# EAGLE design outin_shield (EAGLE 7.2.0)
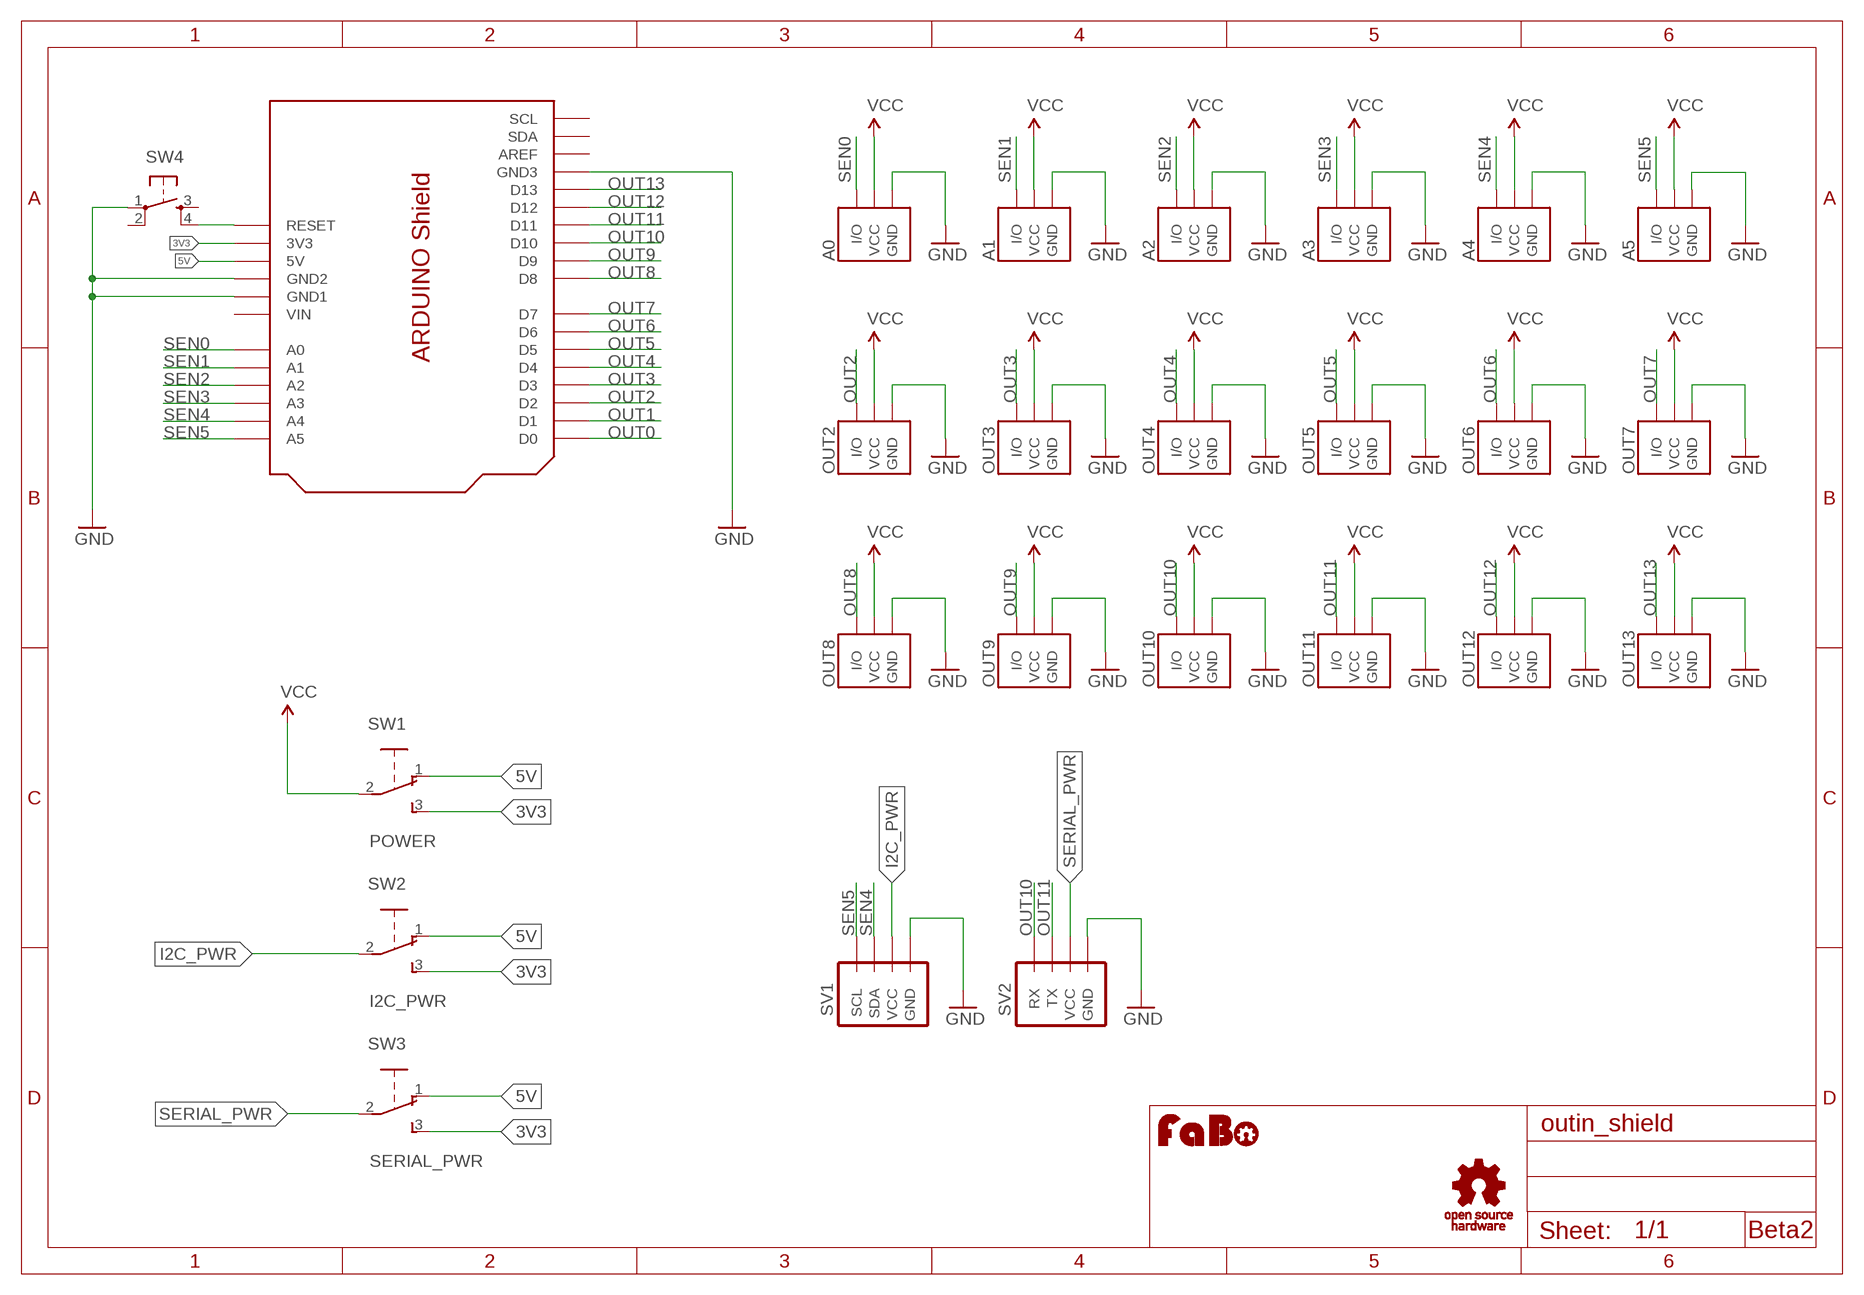
[diagram p0: schematic, sheet 1]

## Parts
A0  IO_PIN-3PIN  [1X3-SNEAKY]
A1  IO_PIN-3PIN  [1X3-SNEAKY]
A2  IO_PIN-3PIN  [1X3-SNEAKY]
A3  IO_PIN-3PIN  [1X3-SNEAKY]
A4  IO_PIN-3PIN  [1X3-SNEAKY]
A5  IO_PIN-3PIN  [1X3-SNEAKY]
OUT2  IO_PIN-3PIN  [1X3-SNEAKY]
OUT3  IO_PIN-3PIN  [1X3-SNEAKY]
OUT4  IO_PIN-3PIN  [1X3-SNEAKY]
OUT5  IO_PIN-3PIN  [1X3-SNEAKY]
OUT6  IO_PIN-3PIN  [1X3-SNEAKY]
OUT7  IO_PIN-3PIN  [1X3-SNEAKY]
OUT8  IO_PIN-3PIN  [1X3-SNEAKY]
OUT9  IO_PIN-3PIN  [1X3-SNEAKY]
OUT10  IO_PIN-3PIN  [1X3-SNEAKY]
OUT11  IO_PIN-3PIN  [1X3-SNEAKY]
OUT12  IO_PIN-3PIN  [1X3-SNEAKY]
OUT13  IO_PIN-3PIN  [1X3-SNEAKY]
SV1  BRICK_I2C_CONNECTOR  [BRICK_I2C_CONNECTOR]
SV2  BRICK_SERIAL_CONNECTOR  [BRICK_SERIAL_CONNECTOR]
SW1  POWER  SWITCH-SLIDE-EG1218  [EG1218]
SW2  I2C_PWR  SWITCH-SLIDE-EG1218  [EG1218]
SW3  SERIAL_PWR  SWITCH-SLIDE-EG1218  [EG1218]
SW4  SWITCH-TACT-6MM  [DTS_6_V]
U1  OUTIN_SHIELD  [ARDUINO_UNO_R3_OUTIN]
U$4  LOGO_OSHW_T-M  [LOGO_OSHW_T_M]
U$5  LOGO_FABO-M  [LOGO_FABO_M]

## Nets
3V3 [POWER]: SW1.3 SW2.3 SW3.3 U1.3V3
5V [POWER]: SW1.1 SW2.1 SW3.1 U1.5V
GND [POWER]: A0.1(GND) A1.1(GND) A2.1(GND) A3.1(GND) A4.1(GND) A5.1(GND) OUT2.1(GND) OUT3.1(GND) OUT4.1(GND) OUT5.1(GND) OUT6.1(GND) OUT7.1(GND) OUT8.1(GND) OUT9.1(GND) OUT10.1(GND) OUT11.1(GND) OUT12.1(GND) OUT13.1(GND) SV1.GND SV2.GND SW4.1 U1.GND1 U1.GND2 U1.GND3
I2C_PWR [POWER]: SV1.VCC SW2.2
OUT0: U1.D0
OUT1: U1.D1
OUT2: OUT2.3(I/O) U1.D2
OUT3: OUT3.3(I/O) U1.D3
OUT4: OUT4.3(I/O) U1.D4
OUT5: OUT5.3(I/O) U1.D5
OUT6: OUT6.3(I/O) U1.D6
OUT7: OUT7.3(I/O) U1.D7
OUT8: OUT8.3(I/O) U1.D8
OUT9: OUT9.3(I/O) U1.D9
OUT10: OUT10.3(I/O) SV2.RX U1.D10
OUT11: OUT11.3(I/O) SV2.TX U1.D11
OUT12: OUT12.3(I/O) U1.D12
OUT13: OUT13.3(I/O) U1.D13
RESET: SW4.4 U1.RESET
SEN0: A0.3(I/O) U1.A0
SEN1: A1.3(I/O) U1.A1
SEN2: A2.3(I/O) U1.A2
SEN3: A3.3(I/O) U1.A3
SEN4: A4.3(I/O) SV1.SDA U1.A4
SEN5: A5.3(I/O) SV1.SCL U1.A5
SERIAL_PWR [POWER]: SV2.VCC SW3.2
VCC [POWER]: A0.2(VCC) A1.2(VCC) A2.2(VCC) A3.2(VCC) A4.2(VCC) A5.2(VCC) OUT2.2(VCC) OUT3.2(VCC) OUT4.2(VCC) OUT5.2(VCC) OUT6.2(VCC) OUT7.2(VCC) OUT8.2(VCC) OUT9.2(VCC) OUT10.2(VCC) OUT11.2(VCC) OUT12.2(VCC) OUT13.2(VCC) SW1.2
Unconnected: SW4.2 SW4.3 U1.AREF U1.SCL U1.SDA

## Notes on the sheet
- Beta2

## Power pins joined to a net without a drawn wire
VIN: U1.VIN

## Library data of the parts
A0 A1-A5 OUT2-OUT13 = Gclue:IO_PIN
SV1 = Gclue:BRICK_I2C_CONNECTOR: Brick Connector female for OUT/IN Shield
SV2 = Gclue:BRICK_SERIAL_CONNECTOR
SW1-SW3 = Gclue:SWITCH-SLIDE
SW4 = Gclue:SWITCH-TACT
U1 = Gclue:OUTIN_SHIELD
U$4 = Gclue:LOGO_OSHW_T
U$5 = FaBo:LOGO_FABO

## Net classes
1 POWER: width 0.406 mm

## Board
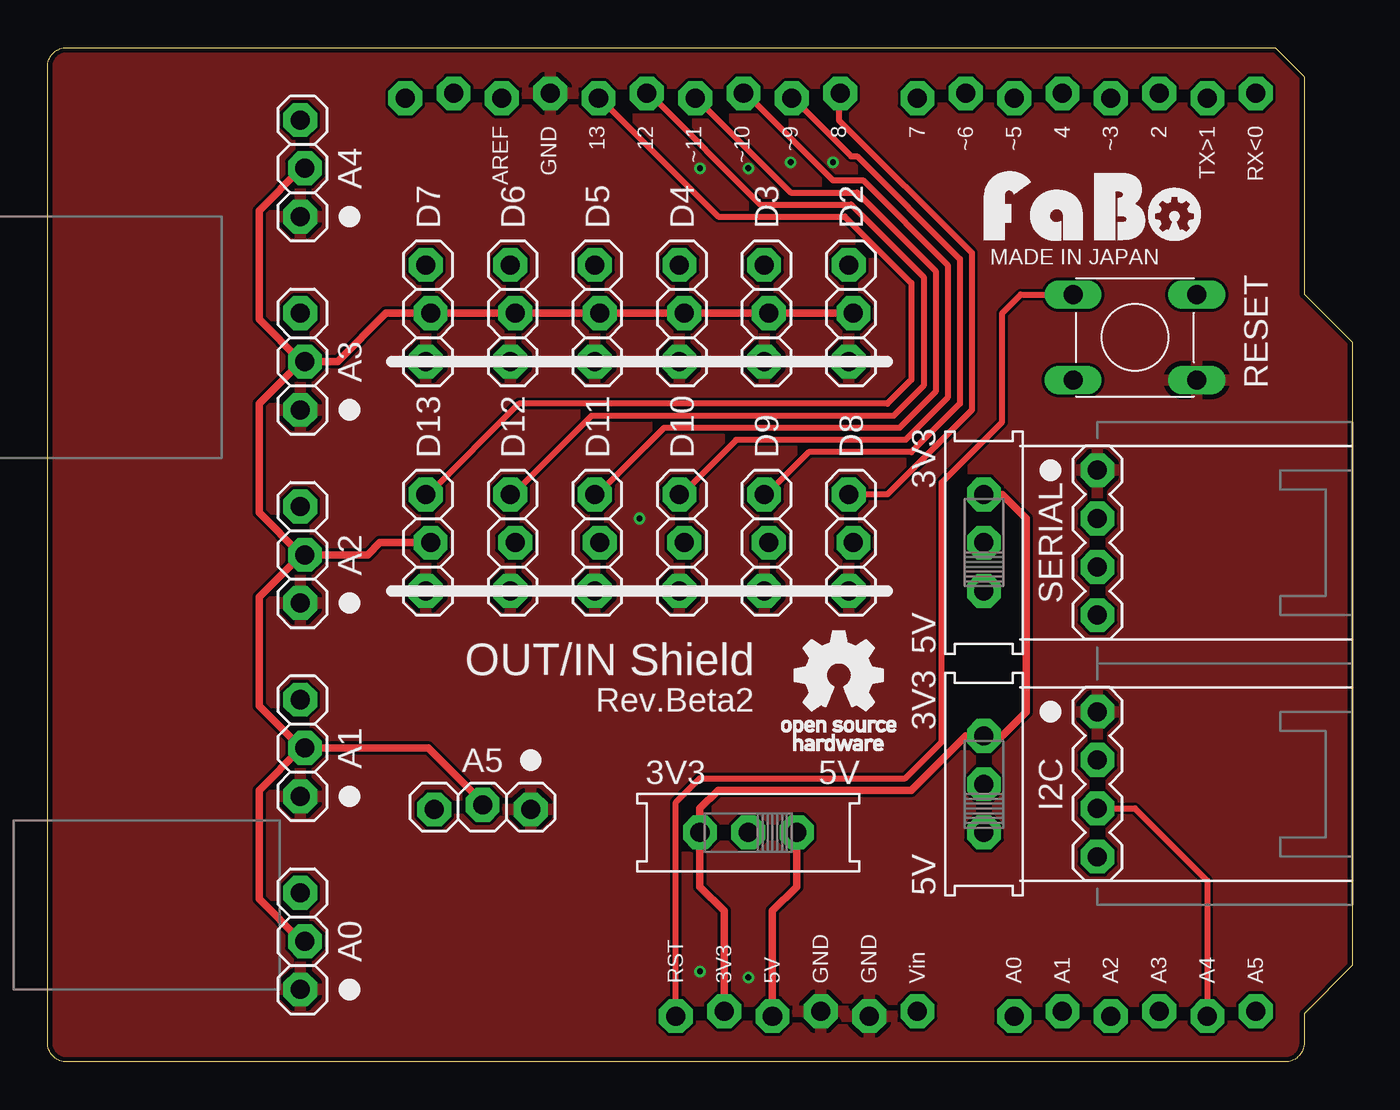
[diagram p1: board, top side]
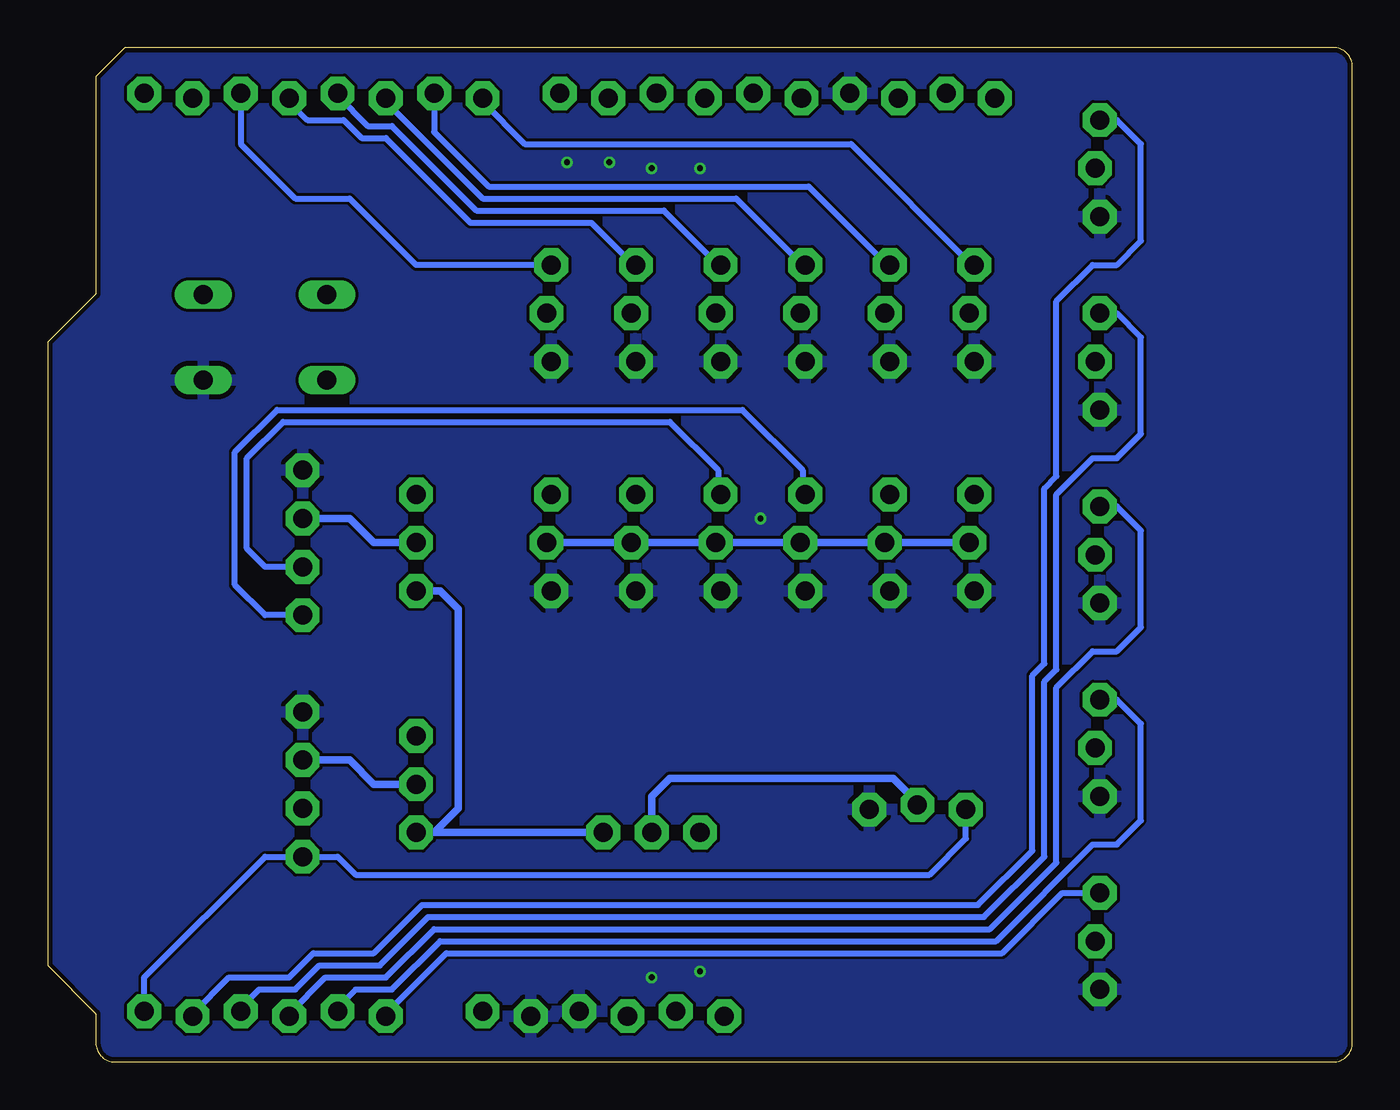
[diagram p2: board, bottom side, seen from below]

Size 68.58 x 53.34 mm. Coordinates in mm from the lower left corner, seen from the top.
Copper layers (1*16): Top 0.035mm / dielectric 1.5mm / Bottom 0.035mm
Design rules "Elecrow_2-layer_eagle_rule": minimum track width 6mil, minimum drill 12mil, track to track 6mil, track to pad 6mil, pad to pad 6mil, via to via 6mil, smd to smd 0mil, copper to edge 10mil, drill to drill 10mil, minimum pad ring 10mil, minimum via ring 6mil, stop-mask expansion 2mil, vias tented up to drill 100mil, thermal gap 10mil

### Footprints (pad centres in the part's own frame; a part is rotated, then mirrored left to right if it is on the bottom)
1X3-SNEAKY = drill 1 pad 1.778 octagon: 1 -2.54,0.127; 2 0,-0.127; 3 2.54,0.127
BRICK_I2C_CONNECTOR = drill 1 pad 1.778 octagon: GND -3.81,0; SCL 3.81,0; SDA 1.27,0; VCC -1.27,0
BRICK_SERIAL_CONNECTOR = drill 1 pad 1.778 octagon: GND -3.81,0; RX 1.27,0; TX 3.81,0; VCC -1.27,0
EG1218 = drill 1 pad 1.778 octagon: 1 -2.54,0; 2 0,0; 3 2.54,0
DTS_6_V = drill 1 long: 1 -3.25,2.25; 2 3.25,2.25; 3 -3.25,-2.25; 4 3.25,-2.25
ARDUINO_UNO_R3_OUTIN = drill 1 pad 1.778 octagon: 3V3 35.56,2.667; 5V 38.1,2.413; A0 50.8,2.413; A1 53.34,2.667; A2 55.88,2.413; A3 58.42,2.667; A4 60.96,2.413; A5 63.5,2.667; AREF 23.876,50.673; D0 63.5,50.927; D1 60.96,50.673; D2 58.42,50.927; D3 55.88,50.673; D4 53.34,50.927; D5 50.8,50.673; D6 48.26,50.927; D7 45.72,50.673; D8 41.656,50.927; D9 39.116,50.673; D10 36.576,50.927; D11 34.036,50.673; D12 31.496,50.927; D13 28.956,50.673; GND1 43.18,2.413; GND2 40.64,2.667; GND3 26.416,50.927; RESET 33.02,2.413; SCL 18.796,50.673; SDA 21.336,50.927; VIN 45.72,2.667

### Placement (x,y rotation side)
A0  13.4,6.35 90 top
A1  13.4,16.51 90 top
A2  13.4,26.67 90 top
A3  13.4,36.83 90 top
A4  13.4,46.99 90 top
A5  22.86,13.4 180 top
OUT2  42.23,39.37 90 top
OUT3  37.78,39.37 90 top
OUT4  33.34,39.37 90 top
OUT5  28.89,39.37 90 top
OUT6  24.45,39.37 90 top
OUT7  20,39.37 90 top
OUT8  42.23,27.3 90 top
OUT9  37.78,27.3 90 top
OUT10  33.34,27.3 90 top
OUT11  28.89,27.3 90 top
OUT12  24.45,27.3 90 top
OUT13  20,27.3 90 top
SV1  55.18,14.61 270 top
SV2  55.18,27.3 270 top
SW1  36.83,12.06 180 top
SW2  49.21,14.61 90 top
SW3  49.21,27.3 90 top
SW4  57.15,38.1 180 top
U1  0,0 0 top
U$4  41.59,20.32 0 top
U$5  54.93,43.18 0 top

### Tracks (layer width: path | path; a pad name or v marks a point on that pad's centre or on a via)
3V3
  Top 0.406: U1.3V3 35.56,7.94 34.29,9.21 SW1.3 34.29,13.34 35.24,14.29 45.4,14.29 48.26,17.14 SW2.3 50.16,17.14 51.44,18.41 51.44,28.57 50.16,29.84 SW3.3
5V
  Top 0.406: U1.5V 38.1,7.94 39.37,9.21 SW1.1
  Bottom 0.406: SW1.1 48.26,12.06 | SW2.1 48.26,12.06 | 48.26,12.06 46.99,13.34 46.99,23.81 47.94,24.77 SW3.1
GND  (via drill 0.3)
  other vias: 36.83,4.45 34.29,4.76 31.11,28.57 34.29,46.99 36.83,46.99 39.05,47.31 41.27,47.31
  pour Bottom: -7.3,54.29 69.53,54.29 69.53,-0.95 -7.3,-0.95
  pour Top: -7.3,54.29 69.53,54.29 69.53,-0.95 -7.3,-0.95
I2C_PWR
  Bottom 0.406: SW2.2 51.44,14.61 52.7,15.88 SV1.VCC
OUT2
  Bottom 0.305: U1.D2 58.42,48.26 55.56,45.4 52.7,45.4 49.21,41.91 OUT2.3
OUT3
  Bottom 0.305: U1.D3 55.88,50.48 54.93,49.53 53.02,49.53 52.07,48.58 50.8,48.58 46.35,44.13 40.01,44.13 37.78,41.91 OUT3.3
OUT4
  Bottom 0.305: U1.D4 53.34,50.8 51.75,49.21 50.48,49.21 46.04,44.77 36.2,44.77 33.34,41.91 OUT4.3
OUT5
  Bottom 0.305: U1.D5 50.8,50.48 45.72,45.4 32.38,45.4 28.89,41.91 OUT5.3
OUT6
  Bottom 0.305: U1.D6 48.26,48.9 45.4,46.04 28.57,46.04 24.45,41.91 OUT6.3
OUT7
  Bottom 0.305: U1.D7 45.72,50.48 43.5,48.26 26.35,48.26 20,41.91 OUT7.3
OUT8
  Top 0.305: U1.D8 41.59,50.8 41.59,49.53 48.58,42.55 48.58,34.29 44.13,29.84 OUT8.3
OUT9
  Top 0.305: U1.D9 39.37,50.48 42.23,47.62 42.55,47.62 47.94,42.23 47.94,34.61 45.4,32.07 40.01,32.07 37.78,29.84 OUT9.3
OUT10
  Top 0.305: U1.D10 36.83,50.8 41.27,46.35 42.86,46.35 47.31,41.91 47.31,34.92 45.09,32.7 36.2,32.7 33.34,29.84 OUT10.3
  Bottom 0.305: SV2.RX 57.15,26.04 58.1,26.99 58.1,31.75 56.2,33.66 35.88,33.66 33.34,31.11 33.34,30.48 33.21,30.35 OUT10.3
OUT11
  Top 0.305: U1.D11 34.29,50.48 39.05,45.72 42.55,45.72 46.67,41.59 46.67,35.24 44.77,33.34 32.38,33.34 28.89,29.84 OUT11.3
  Bottom 0.305: SV2.TX 57.15,23.5 58.74,25.08 58.74,32.07 56.52,34.29 32.07,34.29 28.89,31.11 28.89,30.48 28.77,30.35 OUT11.3
OUT12
  Top 0.305: U1.D12 31.75,50.8 37.47,45.09 42.23,45.09 46.04,41.27 46.04,35.56 44.45,33.97 28.57,33.97 24.45,29.84 OUT12.3
OUT13
  Top 0.305: U1.D13 29.21,50.48 35.24,44.45 41.91,44.45 45.4,40.96 45.4,35.88 44.13,34.61 24.77,34.61 20,29.84 OUT13.3
RESET
  Top 0.305: U1.RESET 33.02,13.65 34.29,14.92 45.09,14.92 46.99,16.83 46.99,30.48 50.16,33.66 50.16,39.37 51.15,40.35 SW4.4
SEN0
  Bottom 0.305: U1.A0 50.8,2.54 47.62,5.71 18.41,5.71 15.24,8.89 A0.3
SEN1
  Bottom 0.305: U1.A1 53.34,2.86 52.39,3.81 50.48,3.81 47.94,6.35 18.73,6.35 13.65,11.43 12.38,11.43 11.11,12.7 11.11,17.78 12.38,19.05 A1.3
SEN2
  Bottom 0.305: U1.A2 55.88,2.54 53.98,4.45 50.8,4.45 48.26,6.99 19.05,6.99 15.56,10.48 15.56,19.68 13.65,21.59 12.38,21.59 11.11,22.86 11.11,27.94 12.38,29.21 A2.3
SEN3
  Bottom 0.305: U1.A3 58.42,2.86 57.47,3.81 55.56,3.81 54.29,5.08 51.12,5.08 48.58,7.62 19.37,7.62 16.19,10.79 16.19,20 15.56,20.64 15.56,29.84 13.65,31.75 12.38,31.75 11.11,33.02 11.11,38.1 12.38,39.37 A3.3
SEN4
  Top 0.305: SV1.SDA 57.15,13.34 60.96,9.53 U1.A4
  Bottom 0.305: U1.A4 60.96,2.54 59.05,4.45 55.88,4.45 54.61,5.71 51.44,5.71 48.9,8.26 19.68,8.26 16.83,11.11 16.83,20.32 16.19,20.95 16.19,30.16 15.56,30.8 15.56,40.01 13.65,41.91 12.38,41.91 11.11,43.18 11.11,48.26 12.38,49.53 A4.3
SEN5
  Bottom 0.305: U1.A5 63.5,4.45 57.15,10.79 SV1.SCL 53.34,10.79 52.39,9.84 22.23,9.84 20.32,11.75 A5.3
SERIAL_PWR
  Bottom 0.406: SW3.2 51.44,27.3 52.7,28.57 SV2.VCC
VCC
  Top 0.406: OUT2.2 OUT3.2 OUT4.2 OUT5.2 OUT6.2 OUT7.2 17.78,39.37 15.24,36.83 A3.2 13.34,36.83 | OUT13.2 17.46,27.3 16.83,26.67 A2.2 13.34,26.67 | A0.2 13.34,6.35 11.11,8.57 11.11,14.29 13.34,16.51 | 13.34,16.51 11.11,18.73 11.11,24.45 13.34,26.67 | 13.34,16.51 A1.2 20,16.51 22.86,13.65 A5.2 | 13.34,26.67 11.11,28.89 11.11,34.61 13.34,36.83 | 13.34,36.83 11.11,39.05 11.11,44.77 13.34,46.99 A4.2
  Bottom 0.406: SW1.2 36.83,13.97 35.88,14.92 24.13,14.92 22.86,13.65 A5.2 | OUT13.2 OUT12.2 OUT11.2 OUT10.2 OUT9.2 OUT8.2

### Text on the board
tPlace: AREF | GND | 13 | 12 | ~11 | ~10 | ~9 | 8 | 7 | ~6 | ~5 | 4 | ~3 | 2 | TX>1 | RX<0 | A4 | D7 | D6 | D5 | D4 | D3 | D2 | MADE IN JAPAN | RESET | A3 | D13 | D12 | D11 | D10 | D9 | D8 | 3V3 | A2 | SERIAL | 5V | OUT/IN Shield | 3V3 | Rev.Beta2 | A1 | A5 | 3V3 | 5V | I2C | 5V | A0 | RST | 3V3 | 5V | GND | GND | Vin | A0 | A1 | A2 | A3 | A4 | A5